# Altium project PCB_Project.PrjPcb
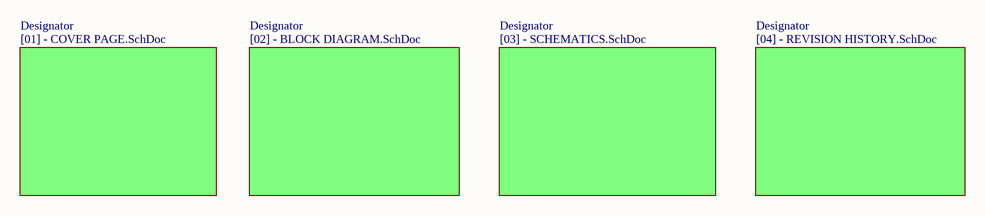
[diagram p0: Bomba_acu.SchDoc]
6 sheets, 26 parts. Net scope: global (net labels, ports and power ports of the same name join across sheets).
Sheets:
  Bomba_acu.SchDoc
    Designator = [01] - COVER PAGE.SchDoc
    Designator = [02] - BLOCK DIAGRAM.SchDoc
    Designator = [03] - SCHEMATICS.SchDoc
    Designator = [04] - REVISION HISTORY.SchDoc
  Bomba_acuario.SchDoc

## Sheet Bomba_acu.SchDoc
size Letter; Author: Paola Andrea Ayala Pineda; Organization: Altium Limited; Address1: L3, 12a Rodborough Rd; Address2: Frenchs Forest; Address3: NSW; Address4: Australia 2086; Revision: 1.0; SheetNumber: 1; SheetTotal: 5; Carnet: 19091

### Sub-sheets
Designator = [01] - COVER PAGE.SchDoc: no entries
Designator = [02] - BLOCK DIAGRAM.SchDoc: no entries
Designator = [03] - SCHEMATICS.SchDoc: no entries
Designator = [04] - REVISION HISTORY.SchDoc: no entries

### Notes on the sheet
- Proyecto:
- Documento:
- Autor:
- Carnet:
- Fecha:
- Revision:
- Tamaño:
- Carta
- Hoja:
- de

## Sheet [01] - COVER PAGE.SchDoc
size Letter; Author: Paola Andrea Ayala Pineda; Organization: Altium Limited; Address1: L3, 12a Rodborough Rd; Address2: Frenchs Forest; Address3: NSW; Address4: Australia 2086; Revision: 1.0; SheetNumber: 1; SheetTotal: 5; Carnet: 19091
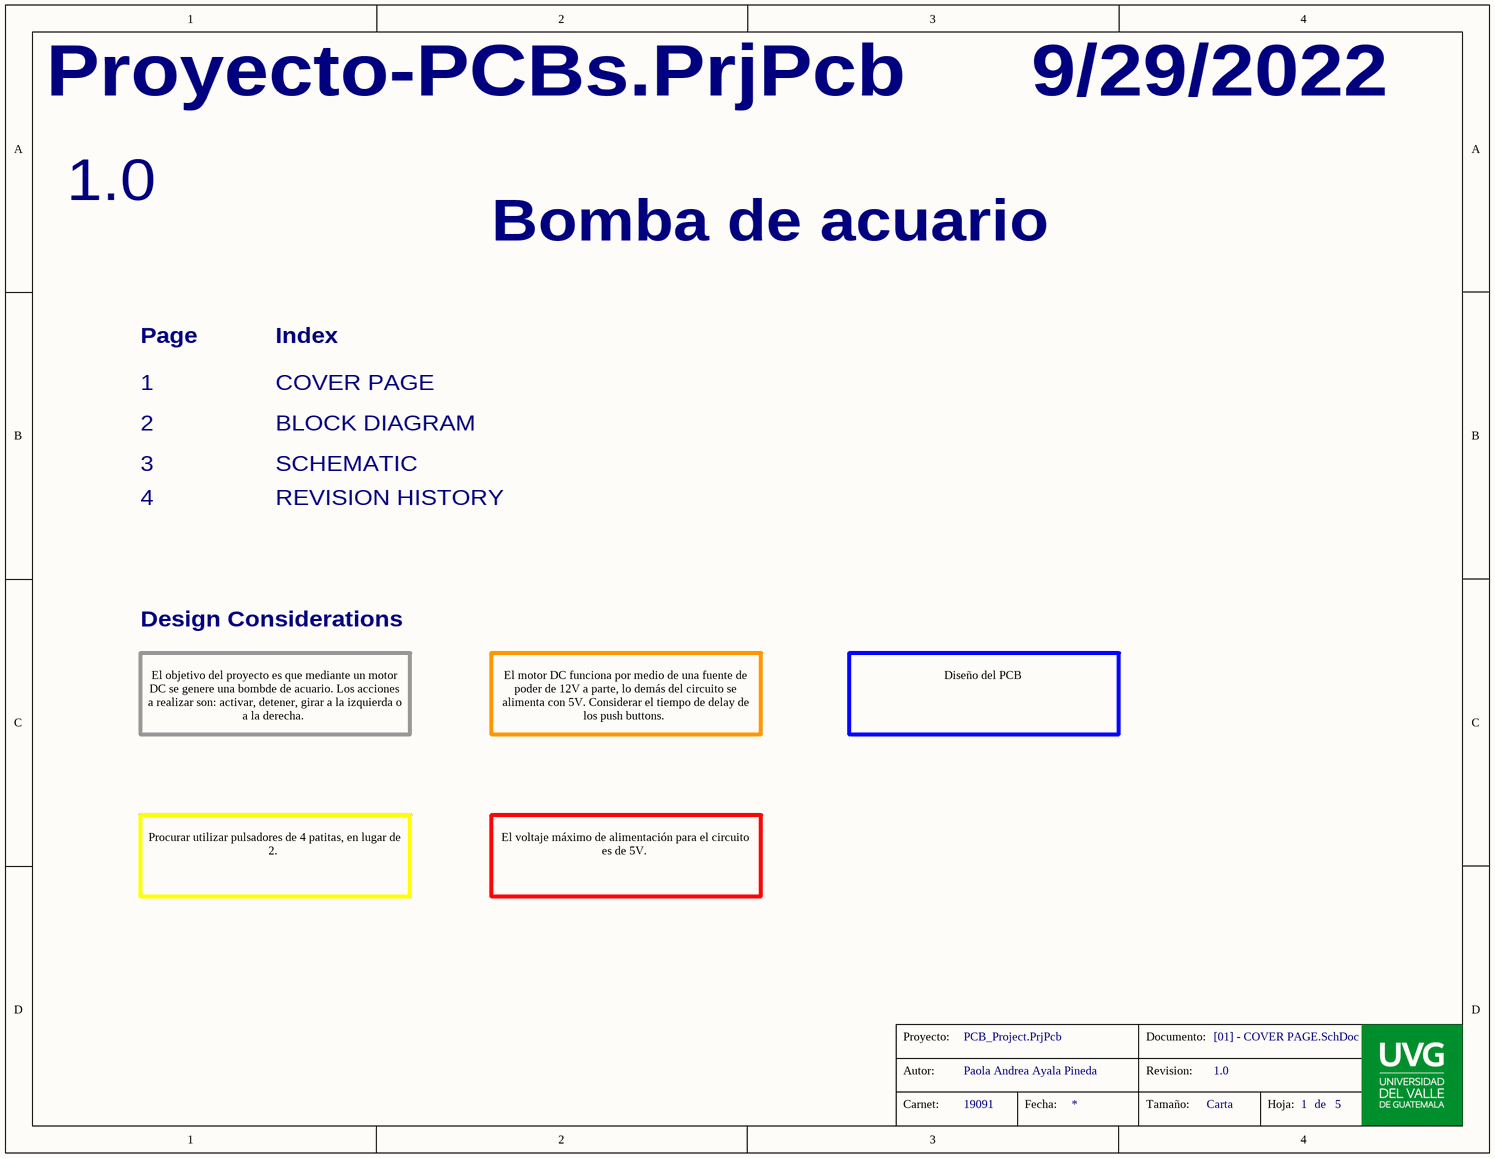
[diagram p1: [01] - COVER PAGE.SchDoc]

### Notes on the sheet
- Proyecto-PCBs.PrjPcb
- 9/29/2022
- 1.0
- Bomba de acuario
- Page
- Index
- 1
- 2
- COVER PAGE
- BLOCK DIAGRAM
- 3
- 4
- SCHEMATIC
- REVISION HISTORY
- Design Considerations
- El objetivo del proyecto es que mediante un motor DC se genere una bombde de acuario. Los acciones a realizar son: activar, detener, girar a la izquierda o a la derecha.
- El motor DC funciona por medio de una fuente de poder de 12V a parte, lo demás del circuito se alimenta con 5V. Considerar el tiempo de delay de los push buttons.
- Diseño del PCB
- Procurar utilizar pulsadores de 4 patitas, en lugar de 2.
- El voltaje máximo de alimentación para el circuito es de 5V.
- Proyecto:
- Documento:
- Autor:
- Carnet:
- Fecha:
- Revision:
- Tamaño:
- Carta
- Hoja:
- de

## Sheet [02] - BLOCK DIAGRAM.SchDoc
size Letter; Author: Paola Andrea Ayala Pineda; Organization: Altium Limited; Address1: L3, 12a Rodborough Rd; Address2: Frenchs Forest; Address3: NSW; Address4: Australia 2086; Revision: 1.0; SheetNumber: 1; SheetTotal: 5; Carnet: 19091
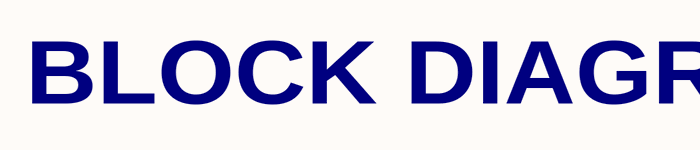
[diagram p2: [02] - BLOCK DIAGRAM.SchDoc]

### Notes on the sheet
- BLOCK DIAGRAM
- Proyecto:
- Documento:
- Autor:
- Carnet:
- Fecha:
- Revision:
- Tamaño:
- Carta
- Hoja:
- de

## Sheet [03] - SCHEMATICS.SchDoc
size Letter; Author: Paola Andrea Ayala Pineda; Organization: Altium Limited; Address1: L3, 12a Rodborough Rd; Address2: Frenchs Forest; Address3: NSW; Address4: Australia 2086; Revision: 1.0; SheetNumber: 1; SheetTotal: 5; Carnet: 19091
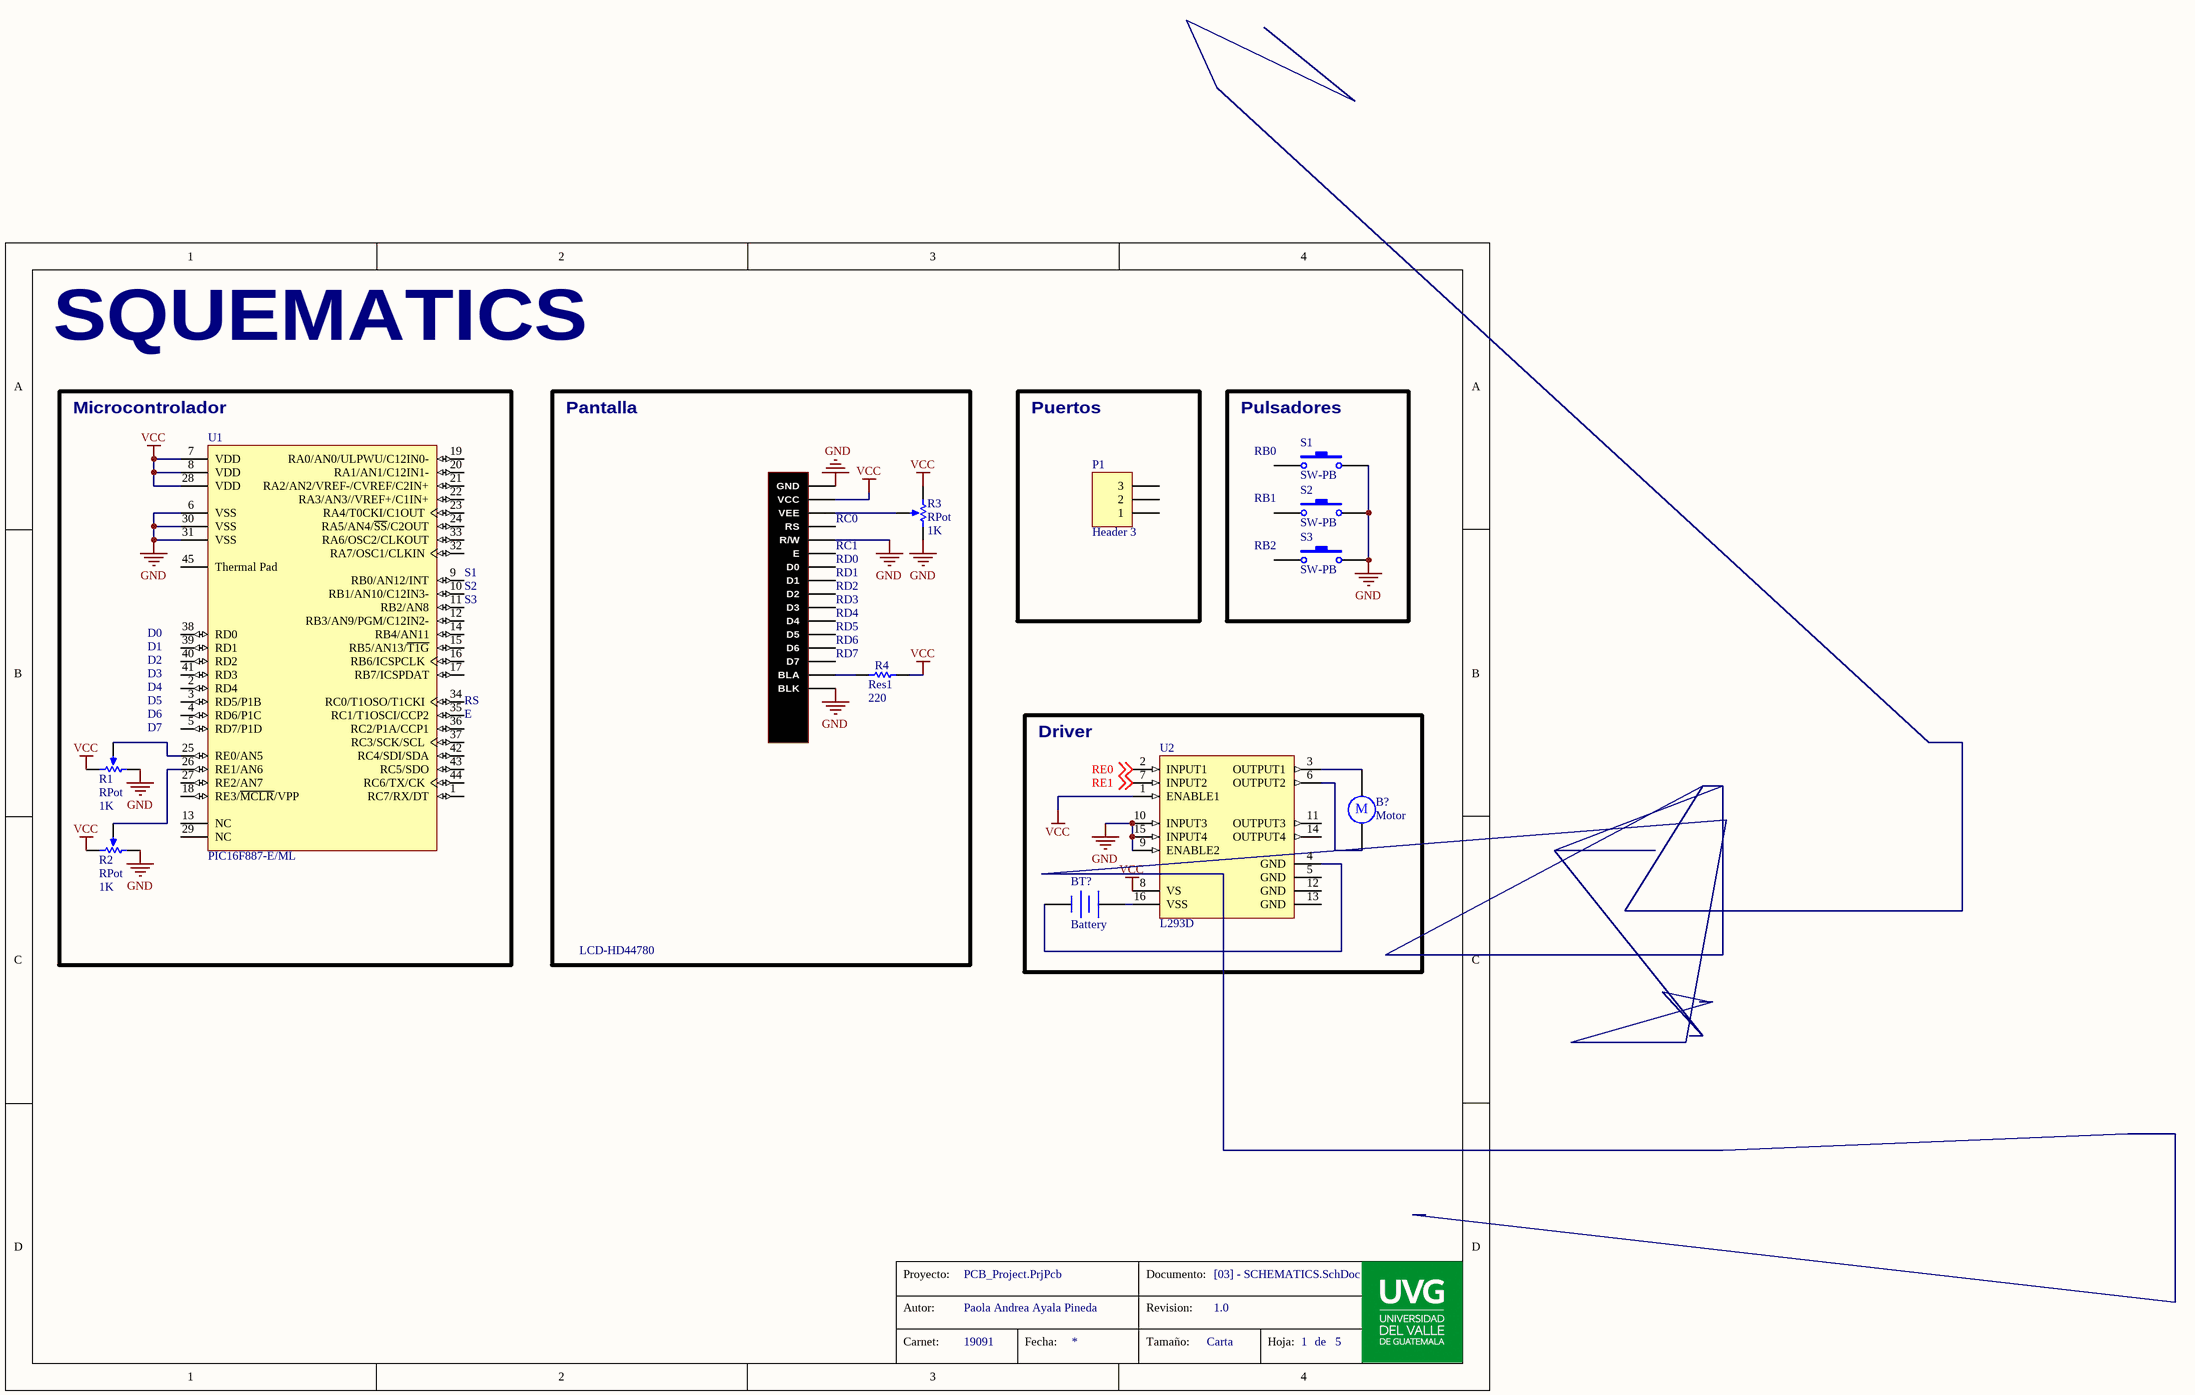
[diagram p3: [03] - SCHEMATICS.SchDoc]

### Parts
(Parts that share a designator on the sheet are numbered #1, #2 ... from top to bottom, then left to right.)
?  LCD-HD44780
B?  Motor  [RB5-10.5]
BT?  Battery  [BAT-2]
P1#1  Header 3  [HDR1X3]
R1#1  RPot  value 1K  [VR5]
R2#1  RPot  value 1K  [VR5]
R3#1  RPot  value 1K  [VR5]
R4#1  Res1  value 220  [AXIAL-0.3]
S1#1  SW-PB  [SPST-2]
S2#1  SW-PB  [SPST-2]
S3#1  SW-PB  [SPST-2]
U1#1  PIC16F887-E/ML  [QFN-ML44_L]
U2#1  L293D  [STM-L293D-16]

### Blocks framed on the sheet
Microcontrolador: R1#1 R2#1 U1#1
Pantalla: ? R3#1 R4#1
Puertos: P1#1
Pulsadores: S1#1 S2#1 S3#1
Driver: B? BT? U2#1

### Nets
  GND: ?.1(GND) ?.5(R/W) ?.16(BLK) R1#1.1(TOP) R2#1.1(TOP) R3#1.2(BOT) S1#1.2 S2#1.2 S3#1.2 U1#1.6(VSS) U1#1.30(VSS) U1#1.31(VSS) U2#1.9(ENABLE2) U2#1.10(INPUT3) U2#1.15(INPUT4)  [also labelled GND]
VCC: ?.2(VCC) R1#1.2(BOT) R2#1.2(BOT) R3#1.1(TOP) R4#1.2 U1#1.7(VDD) U1#1.8(VDD) U1#1.28(VDD) U2#1.1(ENABLE1) U2#1.8(VS)
RE0: U2#1.2(INPUT1) ; off-sheet RE0
RE1: U2#1.7(INPUT2) ; off-sheet RE1
Net?_3: ?.3(VEE) R3#1.3(TAP)
Net?_15: ?.15(BLA) R4#1.1
NetB?_1: B?.1 U2#1.3(OUTPUT1)
NetB?_2: B?.2 U2#1.6(OUTPUT2)
NetBT?_1: BT?.1(+) U2#1.16(VSS)
NetBT?_2: BT?.2(-) U2#1.4(GND)
NetR1#1_3: R1#1.3(TAP) U1#1.25(RE0/AN5)
NetR2#1_3: R2#1.3(TAP) U1#1.26(RE1/AN6)

Not connected (* = marked no-connect by the designer): ? 4(RS) 6(E) 7(D0) 8(D1) 9(D2) 10(D3) 11(D4) 12(D5) 13(D6) 14(D7); P1#1 1 2 3; S1#1 1; S2#1 1; S3#1 1; U1#1 1(RC7/RX/DT) 2(RD4) 3(RD5/P1B) 4(RD6/P1C) 5(RD7/P1D) 9(RB0/AN12/INT) 10(RB1/AN10/C12IN3-) 11(RB2/AN8) 12(RB3/AN9/PGM/C12IN2-) 13(NC) 14(RB4/AN11) 15(RB5/AN13/~{T1G}) 16(RB6/ICSPCLK) 17(RB7/ICSPDAT) 18(RE3/~{MCLR}/VPP) 19(RA0/AN0/ULPWU/C12IN0-) 20(RA1/AN1/C12IN1-) 21(RA2/AN2/VREF-/CVREF/C2IN+) 22(RA3/AN3//VREF+/C1IN+) 23(RA4/T0CKI/C1OUT) 24(RA5/AN4/~{SS}/C2OUT) 27(RE2/AN7) 29(NC) 32(RA7/OSC1/CLKIN) 33(RA6/OSC2/CLKOUT) 34(RC0/T1OSO/T1CKI) 35(RC1/T1OSCI/CCP2) 36(RC2/P1A/CCP1) 37(RC3/SCK/SCL) 38(RD0) 39(RD1) 40(RD2) 41(RD3) 42(RC4/SDI/SDA) 43(RC5/SDO) 44(RC6/TX/CK) 45(Thermal_Pad); U2#1 5(GND) 11(OUTPUT3) 12(GND) 13(GND) 14(OUTPUT4)

### Notes on the sheet
- SQUEMATICS
- (near S1#1) RB0
- RC0
- RB1
- (near U1#1) S1
- (near U1#1) S2
- (near U1#1) S3
- RC1
- RD0
- RD1
- RD2
- RD3
- RB2
- (near U1#1) D0
- (near U1#1) D1
- (near U1#1) D2
- RD4
- (near R4#1) RD5
- (near R4#1) RD6
- (near R4#1) RD7
- (near U1#1) D3
- D4
- D5
- D6
- (near R1#1) D7
- (near U1#1) RS
- (near U1#1) E
- Proyecto:
- Documento:
- Autor:
- Carnet:
- Fecha:
- Revision:
- Tamaño:
- Carta
- Hoja:
- de
- (in symbol Motor) M

### Library data of the parts
? = Component_1
B? = Motor: Motor, General Kind; Published: 24-Mar-1999; LatestRevisionDate: 17-Jul-2002; LatestRevisionNote: Re-released for DXP Platform.; PackageReference: RB5-10.5; Publisher: Altium Limited; PackageDescription: Capacitor (Radial); 2 Leads
BT? = Battery: Multicell Battery; Published: 24-Mar-1999; LatestRevisionDate: 17-Jul-2002; LatestRevisionNote: Re-released for DXP Platform.; PackageReference: BAT-2; Publisher: Altium Limited; PackageDescription: Battery; 2 Leads
P1#1 = Header 3: Header, 3-Pin; LatestRevisionDate: 17-Jul-2002; LatestRevisionNote: Re-released for DXP Platform.; Publisher: Altium Limited
R1#1 R2#1 R3#1 = RPot: Potentiometer; Sim Note: Enter the Resistance value and the set point into parameter fields.; Set Position: 0.5; Published: 8-Jun-2000; LatestRevisionDate: 17-Jul-2002; LatestRevisionNote: Re-released for DXP Platform.; PackageReference: VR5; Publisher: Altium Limited; PackageDescription: Variable Resistor, Thru-Hole; 3 Leads
R4#1 = Res1: Resistor; Published: 8-Jun-2000; LatestRevisionDate: 17-Jul-2002; LatestRevisionNote: Re-released for DXP Platform.; PackageReference: AXIAL-0.3; Publisher: Altium Limited; PackageDescription: Axial Device, Thru-Hole; 2 Leads; 0.3 in Pin Spacing
S1#1 S2#1 S3#1 = SW-PB: Switch; Published: 24-Mar-1999; LatestRevisionDate: 17-Jul-2002; LatestRevisionNote: Re-released for DXP Platform.; PackageReference: SPST-2; Publisher: Altium Limited; PackageDescription: Switch; 2 Leads
U1#1 = PIC16F887-E/ML: Flash-Based, 8-Bit CMOS Microcontroller with nanoWatt Technology, 8K (x14-Bit words) Program Memory, 624 Bytes Data Memory, 35 I/O pins, 44-Pin QFN, Standard VDD Range, Extended Temperature; Published: 29-Jan-2009; LatestRevisionDate: 02-Dec-2009; LatestRevisionNote: Updated datasheet to version revF, Apr-2009.; DatasheetVersion: revF, Apr-2009; PackageVersion: revBB, Aug-2009; PackageReference: QFN-ML44; Publisher: Altium Limited; PackageDescription: 44-Lead Plastic Quad Flat, No Lead Package (ML) - 8x8 mm Body [QFN]; Supplier 1: Digi-Key; Supplier Part Number 1: PIC16F887-E/ML-ND; Code_JEDEC: MO-220; Code_IPC: QFN65P800X800-44V2; ComponentLink1Description: Datasheet; ComponentLink1URL: http://ww1.microchip.com/downloads/en/DeviceDoc/41291F.pdf; ComponentLink2Description: Packaging Specification; ComponentLink2URL: http://www.microchip.com/stellent/groups/techpub_sg/documents/packagingspec/en012702.pdf; ComponentLink3Description: Microchip.com Home; ComponentLink3URL: http://www.microchip.com/
U2#1 = CMP-2000-06524-1: Push-Pull Four Channel Driver with Diode, 4.5 to 36 V, -40 to 150 degC, 16-Pin PDIP, RoHS, Tube; Manufacturer: STMicroelectronics; Number of Outputs: 4; Current - Peak Output: 1.2A; Current - Output / Channel: 600mA; Input Type: Non-Inverting; Other Related Documents: L293DViewAllSpecifications; Dynamic Catalog: HalfBridge; Voltage - Supply: 4.5V~36V; Other Names: 497-2936-5; Package / Case: 16-DIP(0.300",7.62mm); PartNumber: L293D; Operating Temperature: -40°C~150°C; Datasheet URL: http://www.st.com/st-web-ui/static/active/en/resource/technical/document/datasheet/CD00000059.pdf; Supplier Device Package: 16-PowerDIP; Packaging: Tube; Package Description: 16-Pin Thru-Hole Dual-In-Line, Body 20 x 6.85 mm, Pitch 2.54 mm; Standard Package: 25; Datasheet Version: 07/2003; On-State Resistance: -; Manufacturer URL: http://www.st.com/; Category: IntegratedCircuits(ICs); Family: PMIC-MOSFET,BridgeDrivers-InternalSwitch; Type: HalfBridge; Series: -; Mounting Technology: ThroughHole; Package Reference: DIP-16; Mounting Type: ThroughHole

## Sheet [04] - REVISION HISTORY.SchDoc
size Letter; Author: Paola Andrea Ayala Pineda; Organization: Altium Limited; Address1: L3, 12a Rodborough Rd; Address2: Frenchs Forest; Address3: NSW; Address4: Australia 2086; Revision: 1.0; SheetNumber: 1; SheetTotal: 5; Carnet: 19091
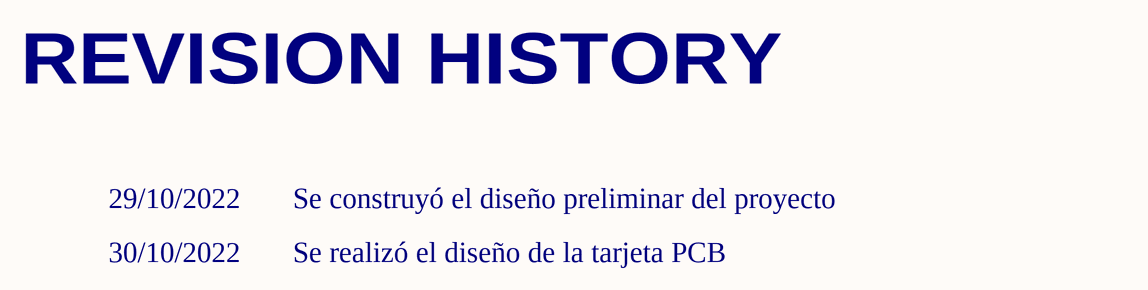
[diagram p4: [04] - REVISION HISTORY.SchDoc]

### Notes on the sheet
- REVISION HISTORY
- 29/10/2022       Se construyó el diseño preliminar del proyecto
- 30/10/2022       Se realizó el diseño de la tarjeta PCB
- Proyecto:
- Documento:
- Autor:
- Carnet:
- Fecha:
- Revision:
- Tamaño:
- Carta
- Hoja:
- de

## Sheet Bomba_acuario.SchDoc
size Letter; Author: Paola Andrea Ayala Pineda; Organization: Altium Limited; Address1: L3, 12a Rodborough Rd; Address2: Frenchs Forest; Address3: NSW; Address4: Australia 2086; Revision: 1.0; SheetNumber: 1; SheetTotal: 5; Carnet: 19091
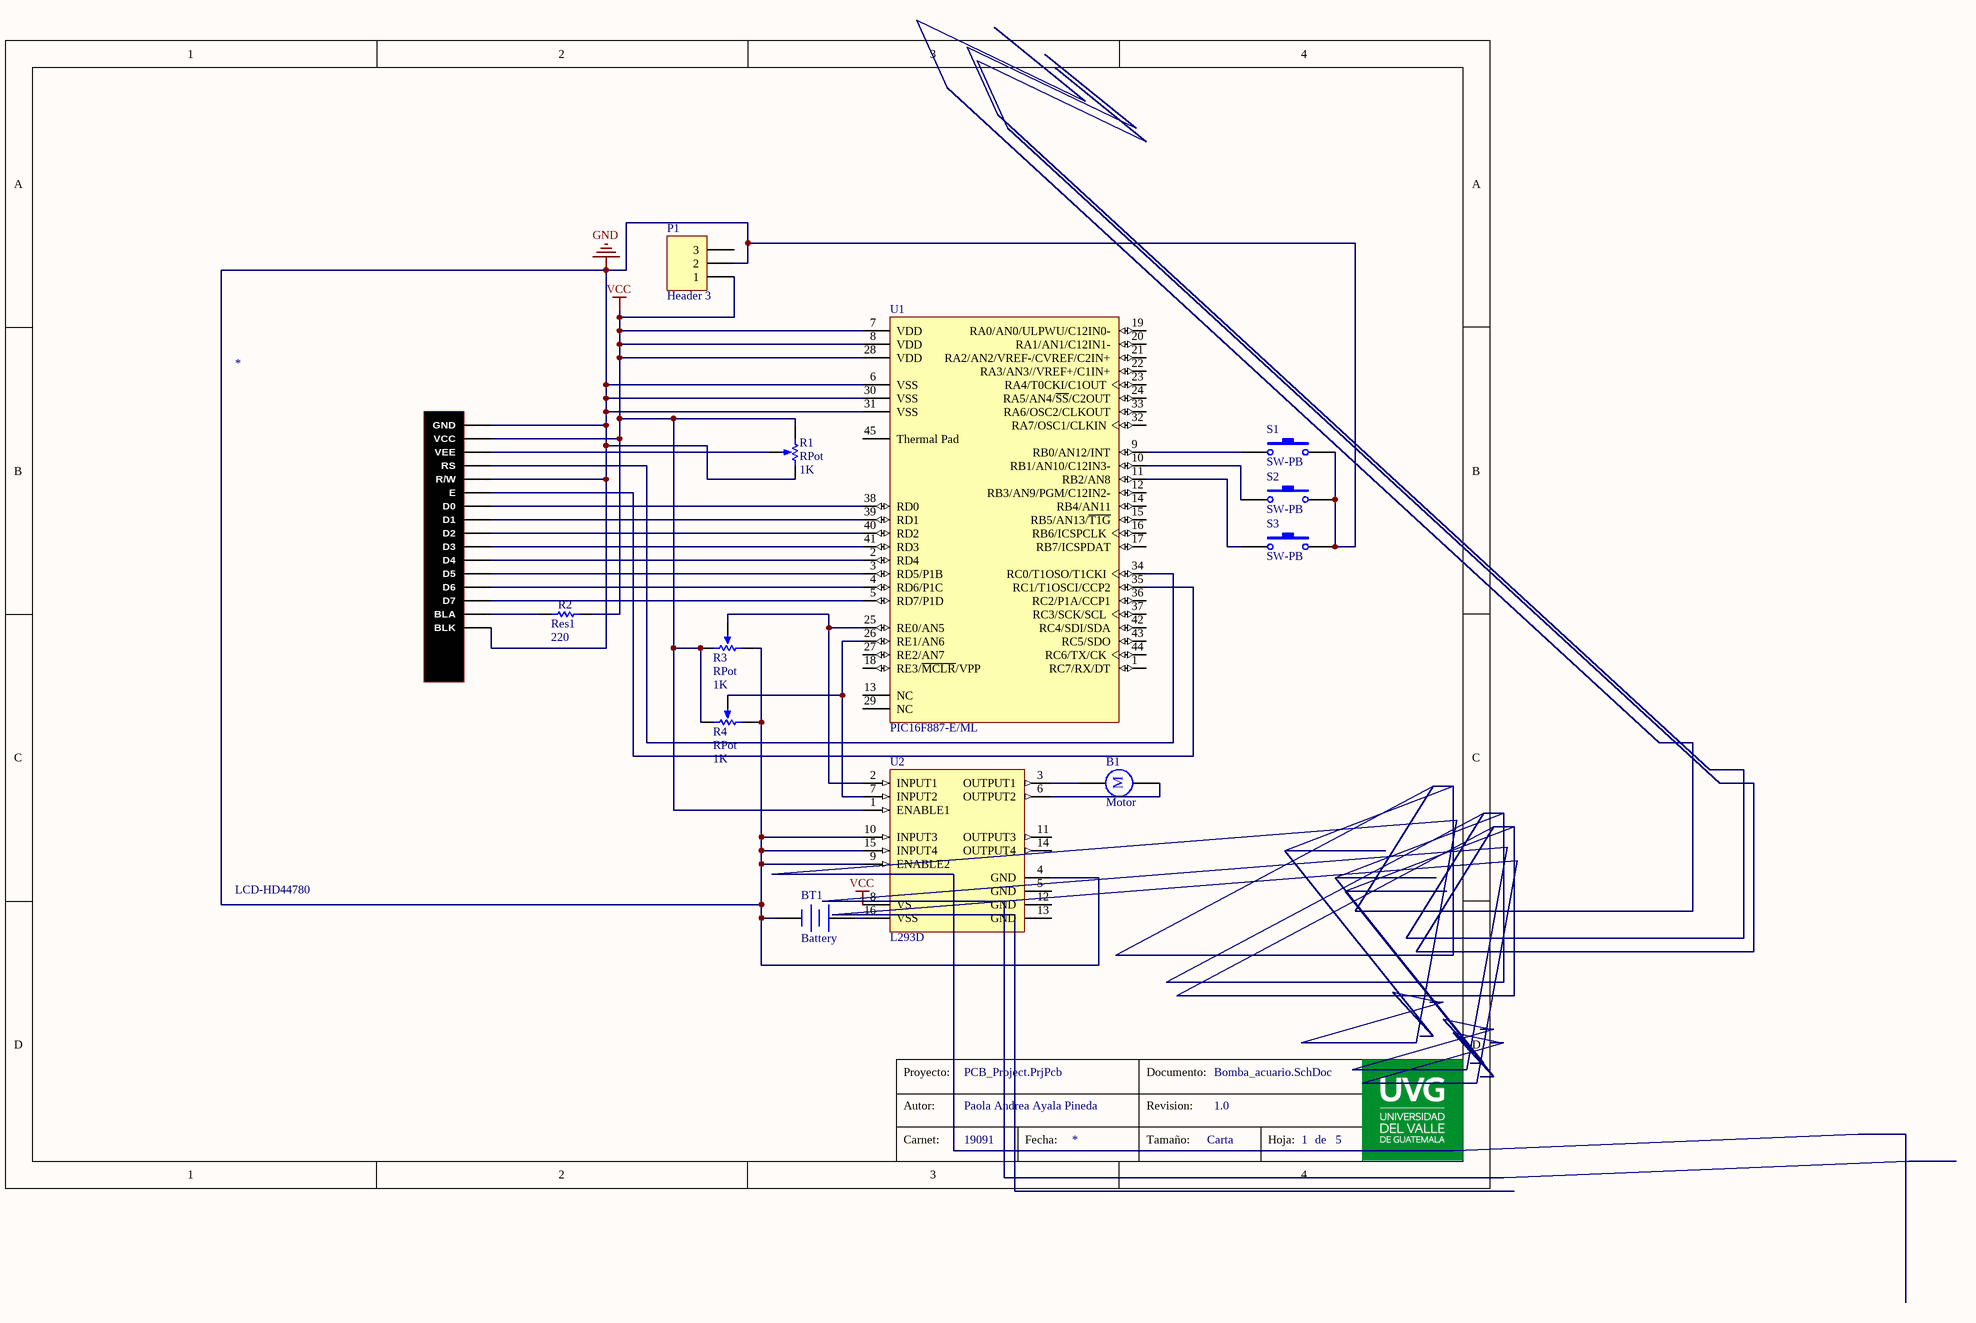
[diagram p5: Bomba_acuario.SchDoc]

### Parts
(Parts that share a designator on the sheet are numbered #1, #2 ... from top to bottom, then left to right.)
*  LCD-HD44780
B1  Motor  [RB5-10.5]
BT1  Battery  [BAT-2]
P1#2  Header 3  [HDR1X3]
R1#2  RPot  value 1K  [VR5]
R2#2  Res1  value 220  [AXIAL-0.3]
R3#2  RPot  value 1K  [VR5]
R4#2  RPot  value 1K  [VR5]
S1#2  SW-PB  [SPST-2]
S2#2  SW-PB  [SPST-2]
S3#2  SW-PB  [SPST-2]
U1#2  PIC16F887-E/ML  [QFN-ML44_L]
U2#2  L293D  [STM-L293D-16]

### Nets
GND: *.1(GND) *.5(R/W) *.16(BLK) BT1.2(-) P1#2.2 R1#2.2(BOT) R3#2.1(TOP) R4#2.1(TOP) S1#2.2 S2#2.2 S3#2.2 U1#2.6(VSS) U1#2.30(VSS) U1#2.31(VSS) U2#2.4(GND) U2#2.9(ENABLE2) U2#2.10(INPUT3) U2#2.15(INPUT4)  [project net   GND]
VCC: *.2(VCC) P1#2.1 R1#2.1(TOP) R2#2.2 R3#2.2(BOT) R4#2.2(BOT) U1#2.7(VDD) U1#2.8(VDD) U1#2.28(VDD) U2#2.1(ENABLE1) U2#2.8(VS)
Net*_3: *.3(VEE) R1#2.3(TAP)
Net*_4: *.4(RS) U1#2.34(RC0/T1OSO/T1CKI)
Net*_6: *.6(E) U1#2.35(RC1/T1OSCI/CCP2)
Net*_7: *.7(D0) U1#2.38(RD0)
Net*_8: *.8(D1) U1#2.39(RD1)
Net*_9: *.9(D2) U1#2.40(RD2)
Net*_10: *.10(D3) U1#2.41(RD3)
Net*_11: *.11(D4) U1#2.2(RD4)
Net*_12: *.12(D5) U1#2.3(RD5/P1B)
Net*_13: *.13(D6) U1#2.4(RD6/P1C)
Net*_14: *.14(D7) U1#2.5(RD7/P1D)
Net*_15: *.15(BLA) R2#2.1
NetB1_1: B1.1 U2#2.3(OUTPUT1)
NetB1_2: B1.2 U2#2.6(OUTPUT2)
NetBT1_1: BT1.1(+) U2#2.16(VSS)
NetR3#2_3: R3#2.3(TAP) U1#2.25(RE0/AN5) U2#2.2(INPUT1)
NetR4#2_3: R4#2.3(TAP) U1#2.26(RE1/AN6) U2#2.7(INPUT2)
NetS1#2_1: S1#2.1 U1#2.9(RB0/AN12/INT)
NetS2#2_1: S2#2.1 U1#2.10(RB1/AN10/C12IN3-)
NetS3#2_1: S3#2.1 U1#2.11(RB2/AN8)

Not connected (* = marked no-connect by the designer): P1#2 3; U1#2 1(RC7/RX/DT) 12(RB3/AN9/PGM/C12IN2-) 13(NC) 14(RB4/AN11) 15(RB5/AN13/~{T1G}) 16(RB6/ICSPCLK) 17(RB7/ICSPDAT) 18(RE3/~{MCLR}/VPP) 19(RA0/AN0/ULPWU/C12IN0-) 20(RA1/AN1/C12IN1-) 21(RA2/AN2/VREF-/CVREF/C2IN+) 22(RA3/AN3//VREF+/C1IN+) 23(RA4/T0CKI/C1OUT) 24(RA5/AN4/~{SS}/C2OUT) 27(RE2/AN7) 29(NC) 32(RA7/OSC1/CLKIN) 33(RA6/OSC2/CLKOUT) 36(RC2/P1A/CCP1) 37(RC3/SCK/SCL) 42(RC4/SDI/SDA) 43(RC5/SDO) 44(RC6/TX/CK) 45(Thermal_Pad); U2#2 5(GND) 11(OUTPUT3) 12(GND) 13(GND) 14(OUTPUT4)

### Notes on the sheet
- Proyecto:
- Documento:
- Autor:
- Carnet:
- Fecha:
- Revision:
- Tamaño:
- Carta
- Hoja:
- de
- (in symbol Motor) M

### Library data of the parts
* = Component_1
B1 = Motor: Motor, General Kind; Published: 24-Mar-1999; LatestRevisionDate: 17-Jul-2002; LatestRevisionNote: Re-released for DXP Platform.; PackageReference: RB5-10.5; Publisher: Altium Limited; PackageDescription: Capacitor (Radial); 2 Leads
BT1 = Battery: Multicell Battery; Published: 24-Mar-1999; LatestRevisionDate: 17-Jul-2002; LatestRevisionNote: Re-released for DXP Platform.; PackageReference: BAT-2; Publisher: Altium Limited; PackageDescription: Battery; 2 Leads
P1#2 = Header 3: Header, 3-Pin; LatestRevisionDate: 17-Jul-2002; LatestRevisionNote: Re-released for DXP Platform.; Publisher: Altium Limited
R1#2 R3#2 R4#2 = RPot: as R1#1 on sheet [03] - SCHEMATICS; Published: 8-Jun-2000; LatestRevisionDate: 17-Jul-2002; LatestRevisionNote: Re-released for DXP Platform.; PackageReference: VR5; Publisher: Altium Limited; PackageDescription: Variable Resistor, Thru-Hole; 3 Leads
R2#2 = Res1: Resistor; Published: 8-Jun-2000; LatestRevisionDate: 17-Jul-2002; LatestRevisionNote: Re-released for DXP Platform.; PackageReference: AXIAL-0.3; Publisher: Altium Limited; PackageDescription: Axial Device, Thru-Hole; 2 Leads; 0.3 in Pin Spacing
S1#2 S2#2 S3#2 = SW-PB: Switch; Published: 24-Mar-1999; LatestRevisionDate: 17-Jul-2002; LatestRevisionNote: Re-released for DXP Platform.; PackageReference: SPST-2; Publisher: Altium Limited; PackageDescription: Switch; 2 Leads
U1#2 = PIC16F887-E/ML: as U1#1 on sheet [03] - SCHEMATICS; Published: 29-Jan-2009; LatestRevisionDate: 02-Dec-2009; LatestRevisionNote: Updated datasheet to version revF, Apr-2009.; DatasheetVersion: revF, Apr-2009; PackageVersion: revBB, Aug-2009; PackageReference: QFN-ML44; Publisher: Altium Limited; PackageDescription: 44-Lead Plastic Quad Flat, No Lead Package (ML) - 8x8 mm Body [QFN]; Supplier 1: Digi-Key; Supplier Part Number 1: PIC16F887-E/ML-ND; Code_JEDEC: MO-220; Code_IPC: QFN65P800X800-44V2; ComponentLink1Description: Datasheet; ComponentLink1URL: http://ww1.microchip.com/downloads/en/DeviceDoc/41291F.pdf; ComponentLink2Description: Packaging Specification; ComponentLink2URL: http://www.microchip.com/stellent/groups/techpub_sg/documents/packagingspec/en012702.pdf; ComponentLink3Description: Microchip.com Home; ComponentLink3URL: http://www.microchip.com/
U2#2 = CMP-2000-06524-1: as U2#1 on sheet [03] - SCHEMATICS; Package / Case: 16-DIP(0.300",7.62mm); PartNumber: L293D; Operating Temperature: -40°C~150°C; Datasheet URL: http://www.st.com/st-web-ui/static/active/en/resource/technical/document/datasheet/CD00000059.pdf; Supplier Device Package: 16-PowerDIP; Packaging: Tube; Package Description: 16-Pin Thru-Hole Dual-In-Line, Body 20 x 6.85 mm, Pitch 2.54 mm; Standard Package: 25; Datasheet Version: 07/2003; On-State Resistance: -; Manufacturer URL: http://www.st.com/; Category: IntegratedCircuits(ICs); Family: PMIC-MOSFET,BridgeDrivers-InternalSwitch; Type: HalfBridge; Series: -; Mounting Technology: ThroughHole; Package Reference: DIP-16; Mounting Type: ThroughHole

## Nets that join several sheets
  GND: [03] - SCHEMATICS (15 pins), Bomba_acuario (18 pins)
VCC: [03] - SCHEMATICS (10 pins), Bomba_acuario (11 pins)